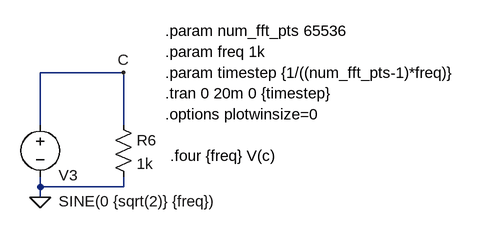
[diagram p0: schematic sine_gen.asc]
sine_gen.asc, the LTspice schematic file:
Version 4
SHEET 1 3100 1408
WIRE -304 1136 -432 1136
WIRE -432 1216 -432 1136
WIRE -304 1216 -304 1136
WIRE -432 1312 -432 1296
WIRE -304 1312 -304 1296
WIRE -304 1312 -432 1312
WIRE -432 1328 -432 1312
FLAG -432 1328 0
FLAG -304 1136 C
SYMBOL voltage -432 1200 R0
WINDOW 123 0 0 Left 0
WINDOW 39 0 0 Left 0
WINDOW 3 28 134 Left 0
WINDOW 0 28 94 Left 0
SYMATTR Value SINE(0 {sqrt(2)} {freq})
SYMATTR InstName V3
SYMBOL res -320 1200 R0
SYMATTR InstName R6
SYMATTR Value 1k
TEXT -232 1264 Left 0 !.four {freq} V(c)
TEXT -240 1200 Left 0 !.options plotwinsize=0
TEXT -240 1168 Left 0 !.tran 0 20m 0 {timestep}
TEXT -240 1136 Left 0 !.param timestep {1/((num_fft_pts-1)*freq)}
TEXT -240 1104 Left 0 !.param freq 1k
TEXT -240 1072 Left 0 !.param num_fft_pts 65536

The netlist it stands for:
* sine_gen.asc
V3 C 0 SINE(0 {sqrt(2)} {freq})
R6 C 0 1k
.four {freq} V(c)
.options plotwinsize=0
.tran 0 20m 0 {timestep}
.param timestep {1/((num_fft_pts-1)*freq)}
.param freq 1k
.param num_fft_pts 65536
.backanno
.end